# EAGLE design ftdiy (EAGLE 9.3.0)
CNAME: PepeTech; CREVISION: 2; DESIGNER: Joao Silva
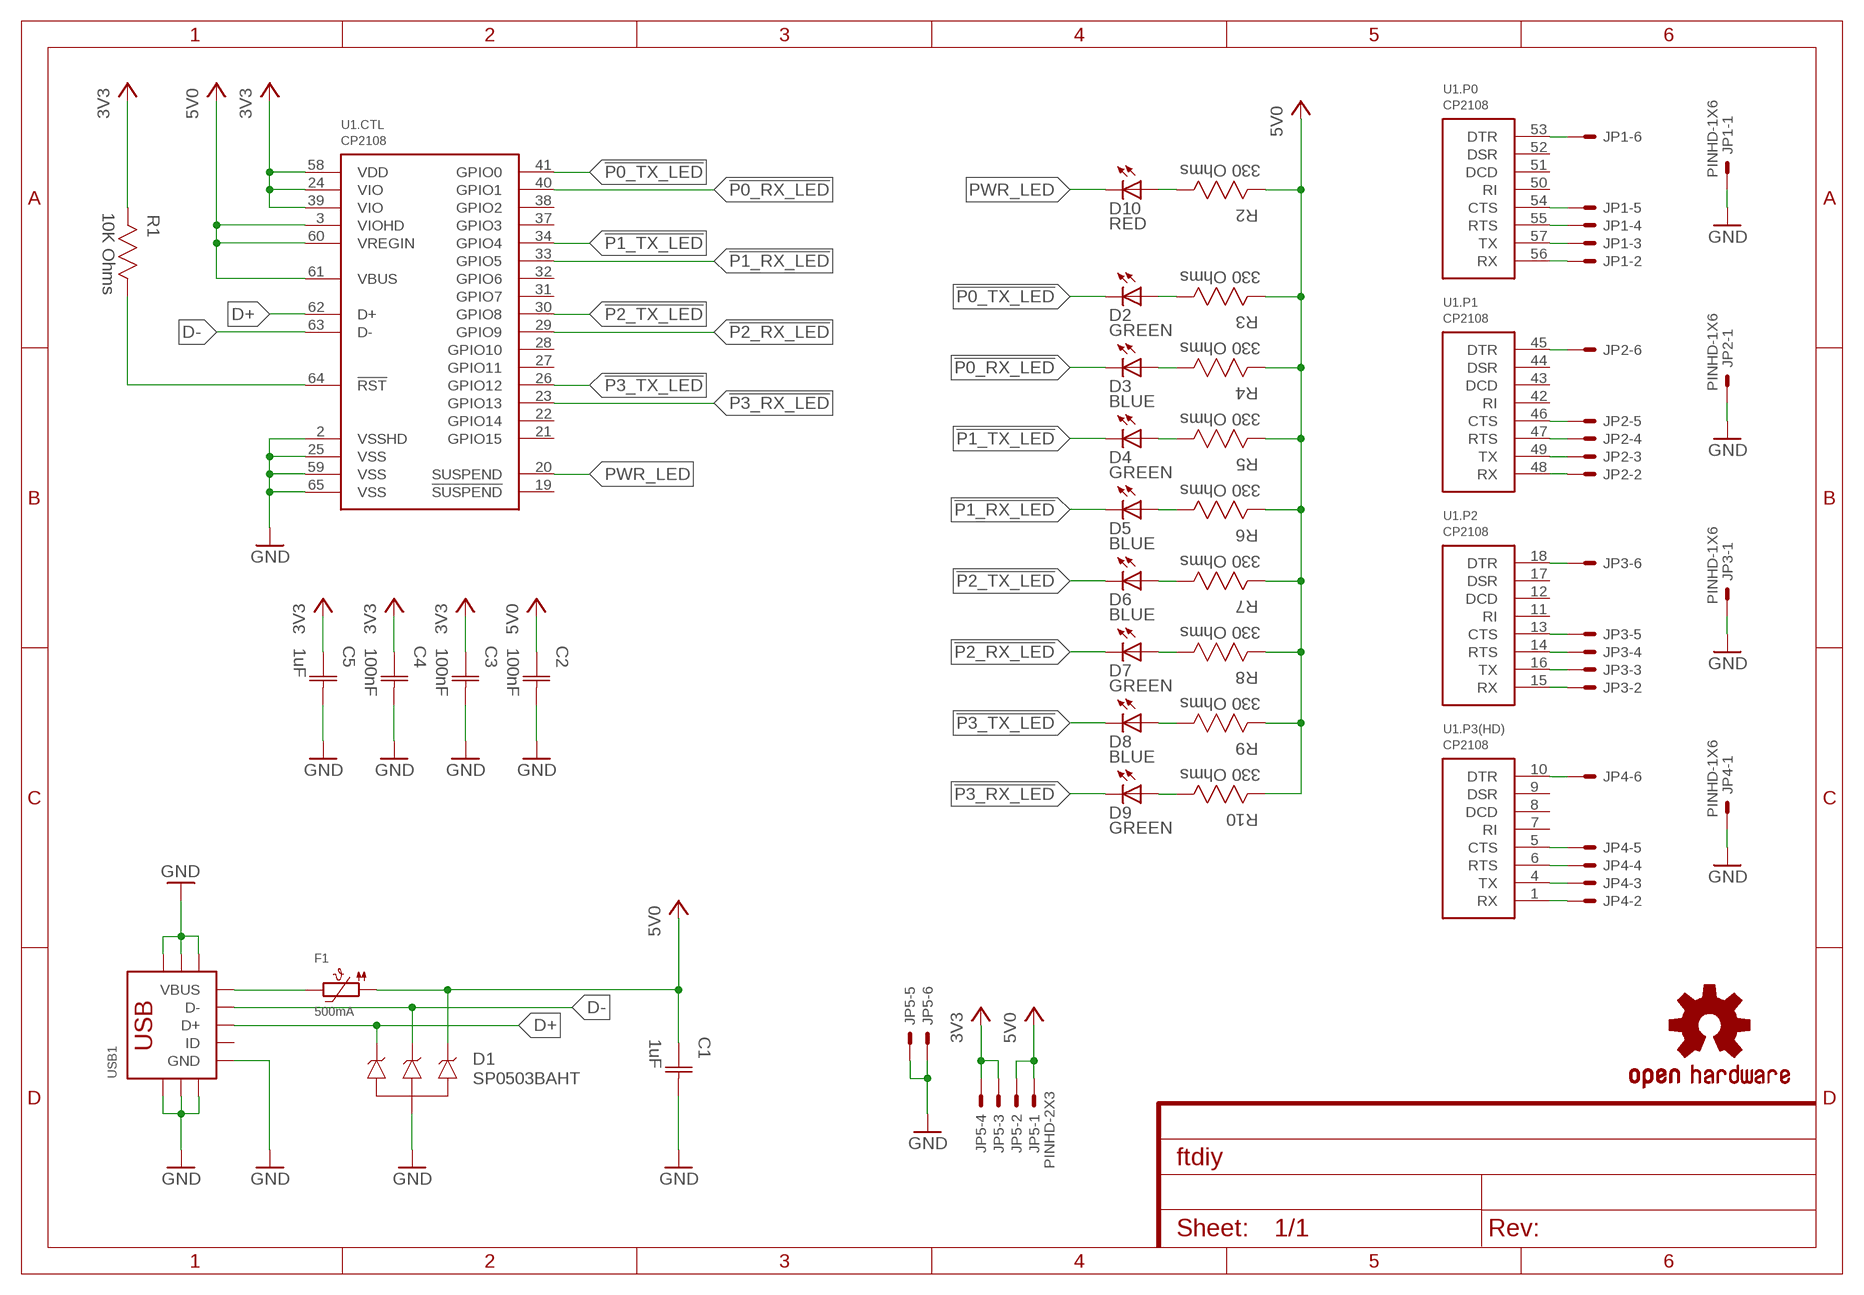
[diagram p0: schematic, sheet 1]

## Parts
C1  1uF  CAPACITOR-0603  [CAP0603]
C2  100nF  CAPACITOR-0603  [CAP0603]
C3  100nF  CAPACITOR-0603  [CAP0603]
C4  100nF  CAPACITOR-0603  [CAP0603]
C5  1uF  CAPACITOR-0603  [CAP0603]
D1  SP0503BAHT  [SOT143]
D2  GREEN  LED0603  [0603]
D3  BLUE  LED0603  [0603]
D4  GREEN  LED0603  [0603]
D5  BLUE  LED0603  [0603]
D6  BLUE  LED0603  [0603]
D7  GREEN  LED0603  [0603]
D8  BLUE  LED0603  [0603]
D9  GREEN  LED0603  [0603]
D10  RED  LED0603  [0603]
F1  500mA  PTC1206  [1206]
JP1  PINHD-1X6  [1X06]
JP2  PINHD-1X6  [1X06]
JP3  PINHD-1X6  [1X06]
JP4  PINHD-1X6  [1X06]
JP5  PINHD-2X3  [2X03]
LOGO1  OSHW-LOGOM  [OSHW-LOGO-M]
R1  10K Ohms  RESISTOR-0603  [RES0603]
R2  330 Ohms  RESISTOR-0603  [RES0603]
R3  330 Ohms  RESISTOR-0603  [RES0603]
R4  330 Ohms  RESISTOR-0603  [RES0603]
R5  330 Ohms  RESISTOR-0603  [RES0603]
R6  330 Ohms  RESISTOR-0603  [RES0603]
R7  330 Ohms  RESISTOR-0603  [RES0603]
R8  330 Ohms  RESISTOR-0603  [RES0603]
R9  330 Ohms  RESISTOR-0603  [RES0603]
R10  330 Ohms  RESISTOR-0603  [RES0603]
U1  CP2108  [QFN64]
USB1  USB-MICRO-B-SMD-FLAT-SIDE  [USB-MICRO-B-SMD-FLAT-SIDE]

## Nets
3V3: C3.1(C1) C4.1(C1) C5.1(C1) JP5.3 JP5.4 R1.2 U1.24(.CTL:VIO) U1.39(.CTL:VIO) U1.58(.CTL:VDD)
5V0: C1.1(C1) C2.1(C1) D1.4 F1.1 JP5.1 JP5.2 R2.2 R3.2 R4.2 R5.2 R6.2 R7.2 R8.2 R9.2 R10.2 U1.3(.CTL:VIOHD) U1.60(.CTL:VREGIN) U1.61(.CTL:VBUS)
!P0_RX_LED: D3.1(C) U1.40(.CTL:GPIO1)
!P0_TX_LED: D2.1(C) U1.41(.CTL:GPIO0)
!P1_RX_LED: D5.1(C) U1.33(.CTL:GPIO5)
!P1_TX_LED: D4.1(C) U1.34(.CTL:GPIO4)
!P2_RX_LED: D7.1(C) U1.29(.CTL:GPIO9)
!P2_TX_LED: D6.1(C) U1.30(.CTL:GPIO8)
!P3_RX_LED: D9.1(C) U1.23(.CTL:GPIO13)
!P3_TX_LED: D8.1(C) U1.26(.CTL:GPIO12)
D+: D1.2 U1.62(.CTL:D+) USB1.D+
D-: D1.3 U1.63(.CTL:D-) USB1.D-
GND: C1.2(C2) C2.2(C2) C3.2(C2) C4.2(C2) C5.2(C2) D1.1 JP1.1 JP2.1 JP3.1 JP4.1 JP5.5 JP5.6 U1.2(.CTL:VSSHD) U1.25(.CTL:VSS) U1.59(.CTL:VSS) U1.65(.CTL:VSS) USB1.GND USB1.SHIELD1(SHIELD) USB1.SHIELD2(SHIELD) USB1.SHIELD3(SHIELD) USB1.SHIELD4(SHIELD) USB1.SHIELD5(SHIELD) USB1.SHIELD6(SHIELD)
N$1: JP1.2 U1.56(.P0:RX)
N$2: JP1.3 U1.57(.P0:TX)
N$3: JP1.4 U1.55(.P0:RTS)
N$4: JP1.5 U1.54(.P0:CTS)
N$5: JP1.6 U1.53(.P0:DTR)
N$6: JP2.2 U1.48(.P1:RX)
N$7: JP2.3 U1.49(.P1:TX)
N$8: JP2.4 U1.47(.P1:RTS)
N$9: JP2.5 U1.46(.P1:CTS)
N$10: JP2.6 U1.45(.P1:DTR)
N$11: JP3.2 U1.15(.P2:RX)
N$12: JP3.3 U1.16(.P2:TX)
N$13: JP3.4 U1.14(.P2:RTS)
N$14: JP3.5 U1.13(.P2:CTS)
N$15: JP3.6 U1.18(.P2:DTR)
N$16: JP4.2 U1.1(.P3(HD):RX)
N$17: JP4.3 U1.4(.P3(HD):TX)
N$18: JP4.4 U1.6(.P3(HD):RTS)
N$19: JP4.5 U1.5(.P3(HD):CTS)
N$20: JP4.6 U1.10(.P3(HD):DTR)
N$21: R1.1 U1.64(.CTL:!RST)
N$22: D10.2(A) R2.1
N$23: D2.2(A) R3.1
N$24: D3.2(A) R4.1
N$25: D4.2(A) R5.1
N$26: D5.2(A) R6.1
N$27: D6.2(A) R7.1
N$28: D7.2(A) R8.1
N$29: D8.2(A) R9.1
N$30: D9.2(A) R10.1
N$31: F1.2 USB1.VBUS
PWR_LED: D10.1(C) U1.20(.CTL:SUSPEND)
Unconnected: U1.7(.P3(HD):RI) U1.8(.P3(HD):DCD) U1.9(.P3(HD):DSR) U1.11(.P2:RI) U1.12(.P2:DCD) U1.17(.P2:DSR) U1.19(.CTL:!SUSPEND) U1.21(.CTL:GPIO15) U1.22(.CTL:GPIO14) U1.27(.CTL:GPIO11) U1.28(.CTL:GPIO10) U1.31(.CTL:GPIO7) U1.32(.CTL:GPIO6) U1.37(.CTL:GPIO3) U1.38(.CTL:GPIO2) U1.42(.P1:RI) U1.43(.P1:DCD) U1.44(.P1:DSR) U1.50(.P0:RI) U1.51(.P0:DCD) U1.52(.P0:DSR) USB1.ID

## Library data of the parts
C1-C5 = Capacitor:CAPACITOR
D1 = TVS:SP0503BAHT
D2-D10 = LED:LED
F1 = PTC Fuses:PTC
JP1-JP4 = Pin Header:PINHD-1X6: PIN HEADER
JP5 = Pin Header:PINHD-2X3: PIN HEADER
LOGO1 = Silkscreen:OSHW-LOGO: Open-Source Hardware (OSHW) Logo This logo indicates the piece of hardware it is found on incorporates a OSHW license and/or adheres to the definition of open source hardware found here: http://freedomdefined.org/OSHW
R1-R10 = Resistor:RESISTOR
U1 = Silicon Labs:CP2108
USB1 = USB Connector:USB-MICRO-B-SMD-FLAT-SIDE

## Board
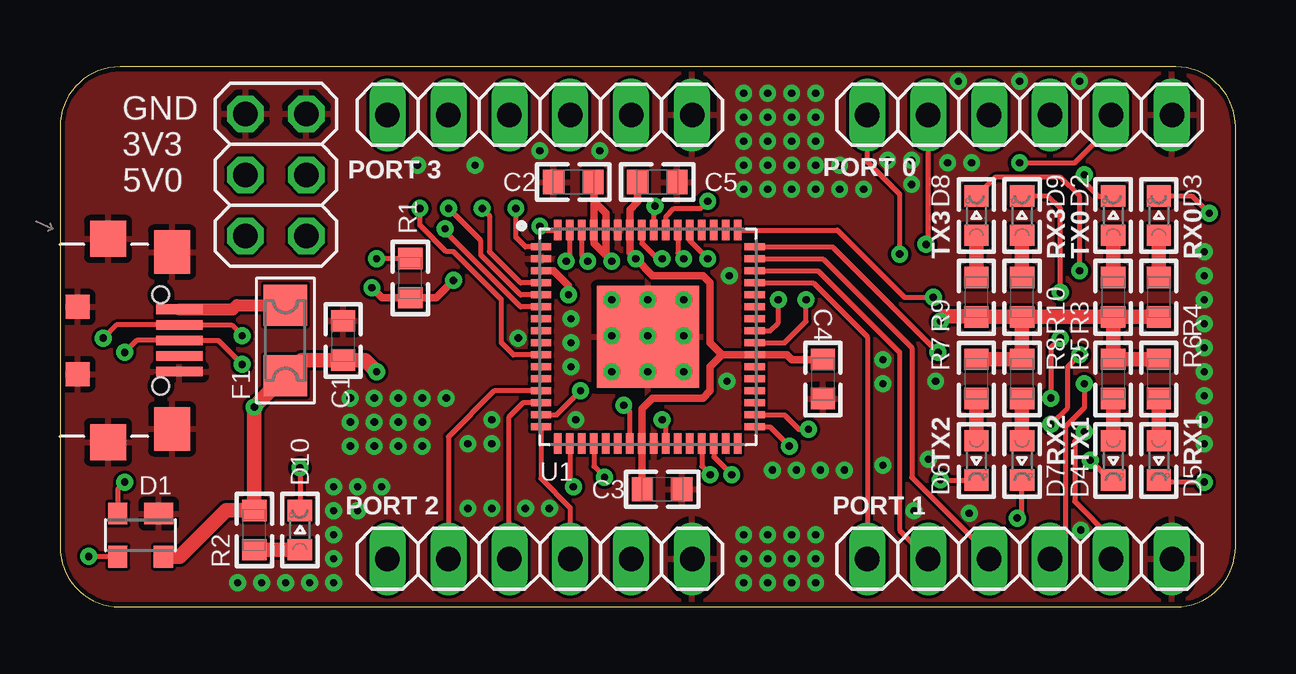
[diagram p1: board, top side]
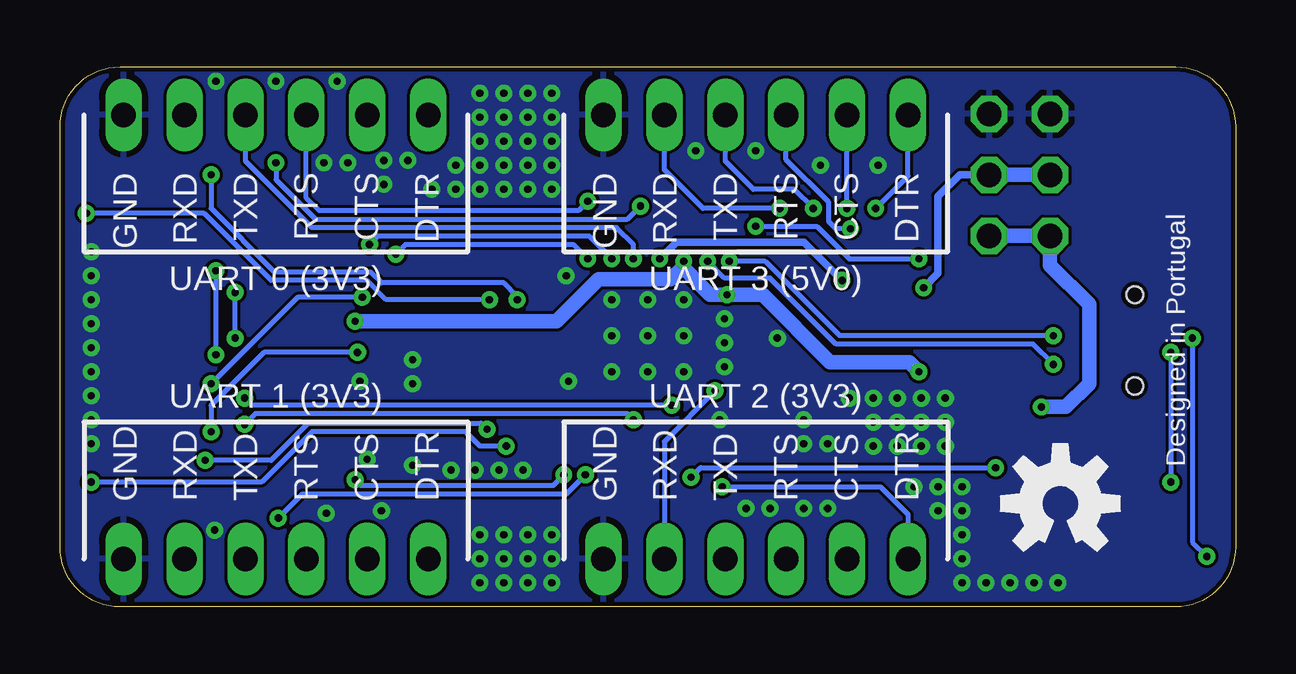
[diagram p2: board, bottom side, seen from below]

Size 49 x 22.5 mm. Coordinates in mm from the lower left corner, seen from the top.
Outline: 46.5,22.5 2.5,22.5 arc90 0,20 0,2.5 arc90 2.5,0 46.5,0 arc90 49,2.5 49,20 arc90 46.5,22.5
Copper layers (1*16): Top 0.035mm / dielectric 1.6mm / Bottom 0.035mm
Design rules "jlcpcb": minimum track width 5mil, minimum drill 0.3mm, track to track 5mil, track to pad 5mil, pad to pad 5mil, via to via 5mil, smd to smd 5mil, copper to edge 0.2mm, drill to drill 5mil, minimum pad ring 10mil, minimum via ring 8mil, stop-mask expansion 4mil, vias tented up to drill 10mm, thermal gap 10mil

### Footprints (pad centres in the part's own frame; a part is rotated, then mirrored left to right if it is on the bottom)
CAP0603 = smd 0.889 x 1.016: 1 -0.819,0; 2 0.819,0
SOT143 = smd 1.2 x 0.9: 1 -0.711,-0.889 | smd 0.8 x 0.9: 2 0.989,-0.889; 3 0.989,0.911; 4 -0.911,0.911
0603 = smd 0.889 x 1.016: 1 -0.819,0; 2 0.819,0
1206 = smd 1.7 x 1.803: 1 -1.472,0; 2 1.472,0
1X06 = drill 1.016 long: 1 -6.35,0; 2 -3.81,0; 3 -1.27,0; 4 1.27,0; 5 3.81,0; 6 6.35,0
2X03 = drill 1.016 octagon: 1 -2.54,-1.27; 2 -2.54,1.27; 3 0,-1.27; 4 0,1.27; 5 2.54,-1.27; 6 2.54,1.27
RES0603 = smd 0.889 x 1.016: 1 -0.819,0; 2 0.819,0
QFN64 = smd 0.85 x 0.3: 1 -4.45,3.75; 2 -4.45,3.25; 3 -4.45,2.75; 4 -4.45,2.25; 5 -4.45,1.75; 6 -4.45,1.25; 7 -4.45,0.75; 8 -4.45,0.25; 9 -4.45,-0.25; 10 -4.45,-0.75; 11 -4.45,-1.25; 12 -4.45,-1.75; 13 -4.45,-2.25; 14 -4.45,-2.75; 15 -4.45,-3.25; 16 -4.45,-3.75; 33 4.45,-3.75; 34 4.45,-3.25; 35 4.45,-2.75; 36 4.45,-2.25; 37 4.45,-1.75; 38 4.45,-1.25; 39 4.45,-0.75; 40 4.45,-0.25; 41 4.45,0.25; 42 4.45,0.75; 43 4.45,1.25; 44 4.45,1.75; 45 4.45,2.25; 46 4.45,2.75; 47 4.45,3.25; 48 4.45,3.75 | smd 0.3 x 0.85: 17 -3.75,-4.45; 18 -3.25,-4.45; 19 -2.75,-4.45; 20 -2.25,-4.45; 21 -1.75,-4.45; 22 -1.25,-4.45; 23 -0.75,-4.45; 24 -0.25,-4.45; 25 0.25,-4.45; 26 0.75,-4.45; 27 1.25,-4.45; 28 1.75,-4.45; 29 2.25,-4.45; 30 2.75,-4.45; 31 3.25,-4.45; 32 3.75,-4.45; 49 3.75,4.45; 50 3.25,4.45; 51 2.75,4.45; 52 2.25,4.45; 53 1.75,4.45; 54 1.25,4.45; 55 0.75,4.45; 56 0.25,4.45; 57 -0.25,4.45; 58 -0.75,4.45; 59 -1.25,4.45; 60 -1.75,4.45; 61 -2.25,4.45; 62 -2.75,4.45; 63 -3.25,4.45; 64 -3.75,4.45 | smd 4.25 x 4.25: 65 0,0
USB-MICRO-B-SMD-FLAT-SIDE = smd 1.95 x 0.4: D+ 2.975,0; D- 2.975,0.65; GND 2.975,-1.3; ID 2.975,-0.65; VBUS 2.975,1.3 | smd 1.5 x 1.5: SHIELD1 0,4.235; SHIELD2 0,-4.235 | smd 1.5 x 1.8: SHIELD3 2.667,3.685; SHIELD4 2.667,-3.685 | smd 1 x 1: SHIELD5 -1.27,1.4; SHIELD6 -1.27,-1.4 | hole 0.7: 2.2,1.9; 2.2,-1.9

### Placement (x,y rotation side)
C1  11.8,11.1 90 top
C2  21.4,17.7 180 top
C3  25.1,4.9 0 top
C4  31.8,9.5 270 top
C5  24.9,17.7 0 top
D1  3.4,3 180 top
D2  43.9,16.3 270 top
D3  45.8,16.3 270 top
D4  43.9,6.1 90 top
D5  45.8,6.1 90 top
D6  38.2,6.1 90 top
D7  40.1,6.1 90 top
D8  38.2,16.3 270 top
D9  40.1,16.3 270 top
D10  10,3.2 270 top
F1  9.4,11.1 90 top
JP1  40,20.5 180 top
JP2  40,2 180 top
JP3  20,2 180 top
JP4  20,20.5 180 top
JP5  9,18 90 top
LOGO1  7.3,4.3 0 bottom
R1  14.6,13.7 270 top
R2  8.1,3.2 90 top
R3  43.9,12.9 270 top
R4  45.8,12.9 270 top
R5  43.9,9.5 90 top
R6  45.8,9.5 90 top
R7  38.2,9.5 90 top
R8  40.1,9.5 90 top
R9  38.2,12.9 270 top
R10  40.1,12.9 270 top
U1  24.5,11.25 0 top
USB1  2,11.1 0 top

### Tracks (layer width: path | path; a pad name or v marks a point on that pad's centre or on a via)
3V3  (via drill 0.3)
  Top 0.305: C5.1 24.08,16.88 23.75,16.55 U1.58 23.75,14.75 v24,14.5 24.7,13.8 26.8,13.8 27.1,13.5 27.1,11 27.6,10.5 | C4.1 31.78,10.3 30.5,10.3 30.3,10.5 U1.39 27.6,10.5 | v16.4,13.6 15.68,12.88 R1.2 13.42,12.88 v13,13.3 | C3.1 24.25,4.93 U1.24 24.25,8.25 24.7,8.7 26.8,8.7 27.1,9 27.1,10 27.6,10.5
  Bottom 0.305: v24,14.5 23.3,15.2 18,15.2 v16.4,13.6 | v13,13.3 12.4,13.9 12.4,17.1 11.5,18 JP5.3
  Bottom 0.61: JP5.4 JP5.3
5V0  (via drill 0.3)
  Top 0.305: 22.25,16.9 U1.61 22.25,15.15 v23,14.4 22.75,14.65 U1.60 22.75,16.4 22.25,16.9 | 22.25,16.9 22.25,17.67 C2.1 | U1.3 20.57,14 21.2,13.37 v21.2,13
  Top 0.61: D1.4 4.99,2.09 6.92,4.02 R2.2 v8.1,8.33 F1.1 10.05,10.28 C1.1 12.72,10.28 v13.2,9.8 | R6.2 R5.2 R3.2 | R3.2 R4.2 | R3.2 R10.2 | R10.2 R9.2 38.18,12.1 36.9,12.1 v36.7,11.9 | R10.2 R8.2 R7.2
  Bottom 0.61: v13.2,9.8 13.6,10.2 16.9,10.2 19.7,13 v21.2,13 21.9,13 23,14.1 v23,14.4 23,14.2 23.55,13.65 26.55,13.65 28.3,11.9 v36.7,11.9 | v8.1,8.33 7.07,8.33 6.1,9.3 6.1,12.6 7.73,14.23 JP5.2 JP5.1
!P0_RX_LED  (via drill 0.3)
  Top 0.2: U1.40 30.2,11 31.1,11.9 v31.1,12.8 | v47.9,16.4 47.2,17.1 45.82,17.1 D3.1
  Bottom 0.2: v47.9,16.4 43,16.4 40.2,13.6 36.2,13.6 35.4,12.8 v31.1,12.8
!P0_TX_LED  (via drill 0.3)
  Top 0.2: v42.7,18 42.7,17.7 43.28,17.12 D2.1 | U1.41 29.6,11.5 29.94,11.84 v29.94,12.8
  Bottom 0.2: v29.94,12.8 29.94,12.94 30.5,13.5 35.6,13.5 36.05,13.95 40.05,13.95 42.7,16.6 v42.7,18
!P1_RX_LED  (via drill 0.3)
  Top 0.2: U1.33 29.6,7.5 v30.4,6.7 | v47.7,5.2 45.88,5.2 D5.1
  Bottom 0.2: v47.7,5.2 40.6,5.2 38.5,7.3 32.1,7.3 31.5,6.7 v30.4,6.7
!P1_TX_LED  (via drill 0.3)
  Top 0.2: U1.34 30.2,8 30.8,7.4 v31.2,7.4 | D4.1 43.77,5.28 v42.95,6.11
  Bottom 0.2: v31.2,7.4 31.45,7.65 38.65,7.65 40.19,6.11 v42.95,6.11
!P2_RX_LED  (via drill 0.3)
  Top 0.2: U1.29 26.75,5.85 v27.1,5.5 | v39.9,3.7 40.1,3.9 D7.1
  Bottom 0.2: v27.1,5.5 27.9,4.7 38.9,4.7 v39.9,3.7
!P2_TX_LED  (via drill 0.3)
  Top 0.2: U1.30 27.25,6.25 v28,5.5 | v36.7,5.3 36.72,5.28 D6.1
  Bottom 0.2: v28,5.5 28.45,5.05 36.45,5.05 v36.7,5.3
!P3_RX_LED  (via drill 0.3)
  Top 0.2: U1.23 23.75,8.15 v23.5,8.4 | v41.7,11.2 41.3,10.8 v41.3,8.7 | v41.7,13.1 41.7,16.6 41.18,17.12 D9.1
  Bottom 0.2: v23.5,8.4 41,8.4 v41.3,8.7 | v41.7,11.2 v41.7,13.1
!P3_TX_LED  (via drill 0.3)
  Top 0.2: U1.26 25.25,7.65 v25.1,7.8 v25.1,7.79 | v41.3,7.6 42,8.3 42,10 v42.5,10.5 | v42.5,14 42.5,17.1 41.7,17.9 40.26,17.9 40.25,17.89 39.75,17.89 39.74,17.9 38.98,17.9 D8.1
  Bottom 0.2: v25.1,7.79 25.35,8.05 40.85,8.05 v41.3,7.6 | v42.5,10.5 v42.5,14
D+  (via drill 0.3)
  Top 0.2: v2.7,10.6 3.2,11.1 USB1.D+ 6.6,11.1 v7.6,10.1 | v2.7,5.2 2.41,4.91 D1.2 | v22,14.4 21.75,14.65 U1.62
  Bottom 0.2: v2.7,10.6 v2.7,5.2 | v7.6,10.1 8.45,10.95 16.65,10.95 19.4,13.7 21.3,13.7 v22,14.4
D-  (via drill 0.3)
  Top 0.2: v1.8,11.2 2.35,11.75 USB1.D- 7.15,11.75 v7.6,11.3 | v1.2,2.1 D1.3 | v21.1,14.4 21.25,14.55 U1.63
  Bottom 0.2: v1.8,11.2 1.8,2.7 v1.2,2.1 | v7.6,11.3 16.5,11.3 19.6,14.4 v21.1,14.4
GND  (via drill 0.3)
  other vias: 23,12.8 24.5,12.8 26,12.8 26,11.3 26,9.8 24.5,9.8 24.5,11.3 23,11.3 23,9.8 31.5,1 30.5,1 29.5,1 28.5,1 28.5,2 28.5,3 29.5,3 30.5,3 31.5,3 31.5,2 30.5,2 29.5,2 18,6.8 17,6.8 18,7.8 18,4.1 17,4.1 20.4,4.1 19.4,4.1 21.5,7.8 27.8,9.4 27.9,13.8 31.5,19.4 30.5,19.4 29.5,19.4 28.5,19.4 28.5,20.4 28.5,21.4 29.5,21.4 30.5,21.4 31.5,21.4 31.5,20.4 30.5,20.4 29.5,20.4 31.5,17.4 30.5,17.4 29.5,17.4 28.5,17.4 31.5,18.4 30.5,18.4 29.5,18.4 28.5,18.4 33.5,17.4 32.5,17.4 32.5,18.4 34.5,18.6 35.5,18.6 35.5,17.6 37,18.5 38,18.5 34.3,9.3 34.3,10.3 36.5,9.4 37.9,3.9 36.2,6.15 34.3,5.9 29.7,5.7 30.7,5.7 31.7,5.7 32.7,5.7 21.3,10 21.3,11 21.3,12 15.1,6.7 14.1,6.7 13.1,6.7 12.1,6.7 12.1,7.7 12.1,8.7 13.1,8.7 14.1,8.7 15.1,8.7 15.1,7.7 14.1,7.7 13.1,7.7 47.7,10.8 47.7,11.8 47.7,12.8 47.7,13.8 47.7,6.8 47.7,7.8 47.7,8.8 47.7,9.8 47.7,14.8 42.5,21.9 35.6,4 11.4,3 11.4,5 12.4,5 13.4,5 12.4,4 11.4,4 11.4,1 11.4,2 9.4,1 10.4,1 7.4,1 8.4,1 16.1,8.7 19.1,11.2 17.3,18.4 14.9,18.4 20,19 22.5,19 42.55,3.2 40,21.9 37.45,21.9
  pour Top: -2.7,25.8 52.2,25.8 52.2,-2.3 -2.7,-2.3
  pour Bottom: -4.4,27.1 53.9,27.1 53.9,-3.4 -4.4,-3.4
N$1  (via drill 0.3)
  Top 0.2: U1.56 24.75,16.65 v24.8,16.7 | v40,18.5 42.3,18.5 43.81,20.01 JP1.2
  Bottom 0.2: 40,18.4 v40,18.5 40,17.8 38.35,16.15 25.35,16.15 v24.8,16.7
N$2  (via drill 0.3)
  Top 0.2: U1.57 24.25,15.15 24.9,14.5 v25.1,14.5
  Bottom 0.2: v25.1,14.5 25.1,15.1 25.8,15.8 38.5,15.8 41.27,18.57 JP1.3
N$3  (via drill 0.3)
  Top 0.2: U1.55 25.25,16.25 25.6,16.6 26.7,16.6 v27,16.9
  Bottom 0.2: v27,16.9 27.39,16.5 38.2,16.5 38.73,17.03 JP1.4
N$4  (via drill 0.3)
  Top 0.2: U1.54 25.75,14.75 v26,14.5 | v36.1,15.1 36.19,15.19 JP1.5
  Bottom 0.2: v26,14.5 26.95,15.45 35.75,15.45 v36.1,15.1
N$5  (via drill 0.3)
  Top 0.2: U1.53 26.25,15.25 v27,14.5 | v35,14.7 35,17.2 33.65,18.55 JP1.6
  Bottom 0.2: v27,14.5 27.59,15.1 34.6,15.1 v35,14.7
N$6  (via drill 0.3)
  Top 0.2: U1.48 32.2,15 v36.6,10.6 | v42.7,7.3 42.3,6.9 42.3,4.4 43.81,2.89 JP2.2
  Bottom 0.2: v36.6,10.6 40.5,10.6 42.7,8.4 v42.7,7.3
N$7  (via drill 0.3)
  Top 0.2: U1.49 32.4,15.7 35.2,12.9 v36.4,12.9 | v42.7,9.3 42.7,8.3 41.9,7.5 41.9,2.63 JP2.3
  Bottom 0.2: v36.4,12.9 39.1,12.9 v42.7,9.3
N$8
  Top 0.2: U1.47 31.8,14.5 35.5,10.8 35.5,5.4 38.73,2.17 JP2.4
N$9
  Top 0.2: U1.46 31.6,14 34.99,10.61 34.99,3.2 JP2.5
N$10
  Top 0.2: U1.45 31.4,13.5 33.65,11.25 JP2.6
N$11  (via drill 0.3)
  Top 0.2: U1.15 20.7,8 v21.7,9
  Bottom 0.2: v21.7,9 23.81,6.89 JP3.2
N$12
  Top 0.2: U1.16 20.05,5.35 21.27,4.13 JP3.3
N$13
  Top 0.2: U1.14 19.3,8.5 18.7,7.9 18.7,2.03 JP3.4
N$14
  Top 0.2: U1.13 18.1,9 16.19,7.09 JP3.5
N$15  (via drill 0.3)
  Top 0.2: U1.18 21.25,5.15 v21.4,5
  Bottom 0.2: JP3.6 13.65,3.85 14.8,5 v21.4,5
N$16  (via drill 0.3)
  Top 0.2: U1.1 19.4,15 19,15.4 v19,16.6
  Bottom 0.2: v19,16.6 22.2,16.6 23.81,18.21 JP4.2
N$17  (via drill 0.3)
  Top 0.2: U1.4 19.2,13.5 17.9,14.8 17.9,16.3 v17.6,16.6
  Bottom 0.2: JP4.3 21.27,18.57 20.1,17.4 18.4,17.4 v17.6,16.6
N$18  (via drill 0.3)
  Top 0.2: U1.6 19.2,12.5 16.05,15.65 v16.05,15.75
  Bottom 0.2: v16.05,15.75 16.65,15.75 16.96,16.06 16.96,16.86 18.73,18.63 JP4.4
N$19  (via drill 0.3)
  Top 0.2: U1.5 19.2,13 17.55,14.65 17.55,15.25 v16.2,16.6
  Bottom 0.2: v16.2,16.6 v16.19,16.61 JP4.5
N$20  (via drill 0.3)
  Top 0.2: U1.10 18.9,10.5 18.4,11 18.4,12.8 16.4,14.8 16.1,14.8 15,15.9 v15,16.6
  Bottom 0.2: v15,16.6 13.65,17.95 JP4.6
N$21  (via drill 0.3)
  Top 0.2: v13.2,14.5 13.22,14.52 R1.1 | v20,15.86 20.16,15.7 U1.64
  Bottom 0.2: v20,15.86 17.46,15.86 16.1,14.5 v13.2,14.5
N$22
  Top 0.61: R2.1 D10.2
N$23
  Top 0.61: R3.1 D2.2
N$24
  Top 0.61: R4.1 D3.2
N$25
  Top 0.61: R5.1 D4.2
N$26
  Top 0.61: R6.1 D5.2
N$27
  Top 0.61: R7.1 D6.2
N$28
  Top 0.61: R8.1 D7.2
N$29
  Top 0.61: R9.1 D8.2
N$30
  Top 0.61: R10.1 D9.2
N$31
  Top 0.508: USB1.VBUS 7.2,12.4 7.37,12.57 F1.2
PWR_LED  (via drill 0.3)
  Top 0.2: U1.20 22.25,5.85 v22.7,5.4 | v10,5.8 D10.1
  Bottom 0.2: v22.7,5.4 22.3,5.8 v10,5.8

### Text on the board
tPlace: PORT 3 | PORT 0 | GND / 3V3 / 5V0 | TX3 | RX3 | TX0 | RX0 | TX2 | RX2 | TX1 | RX1 | PORT 2 | PORT 1
bPlace: GND / RXD / TXD / RTS / CTS / DTR | GND / RXD / TXD / RTS / CTS / DTR | UART 3 (5V0) | UART 0 (3V3) | Designed in Portugal | UART 2 (3V3) | UART 1 (3V3) | GND / RXD / TXD / RTS / CTS / DTR | GND / RXD / TXD / RTS / CTS / DTR